# EAGLE design Seeeduino_Mega (EAGLE 5.06)
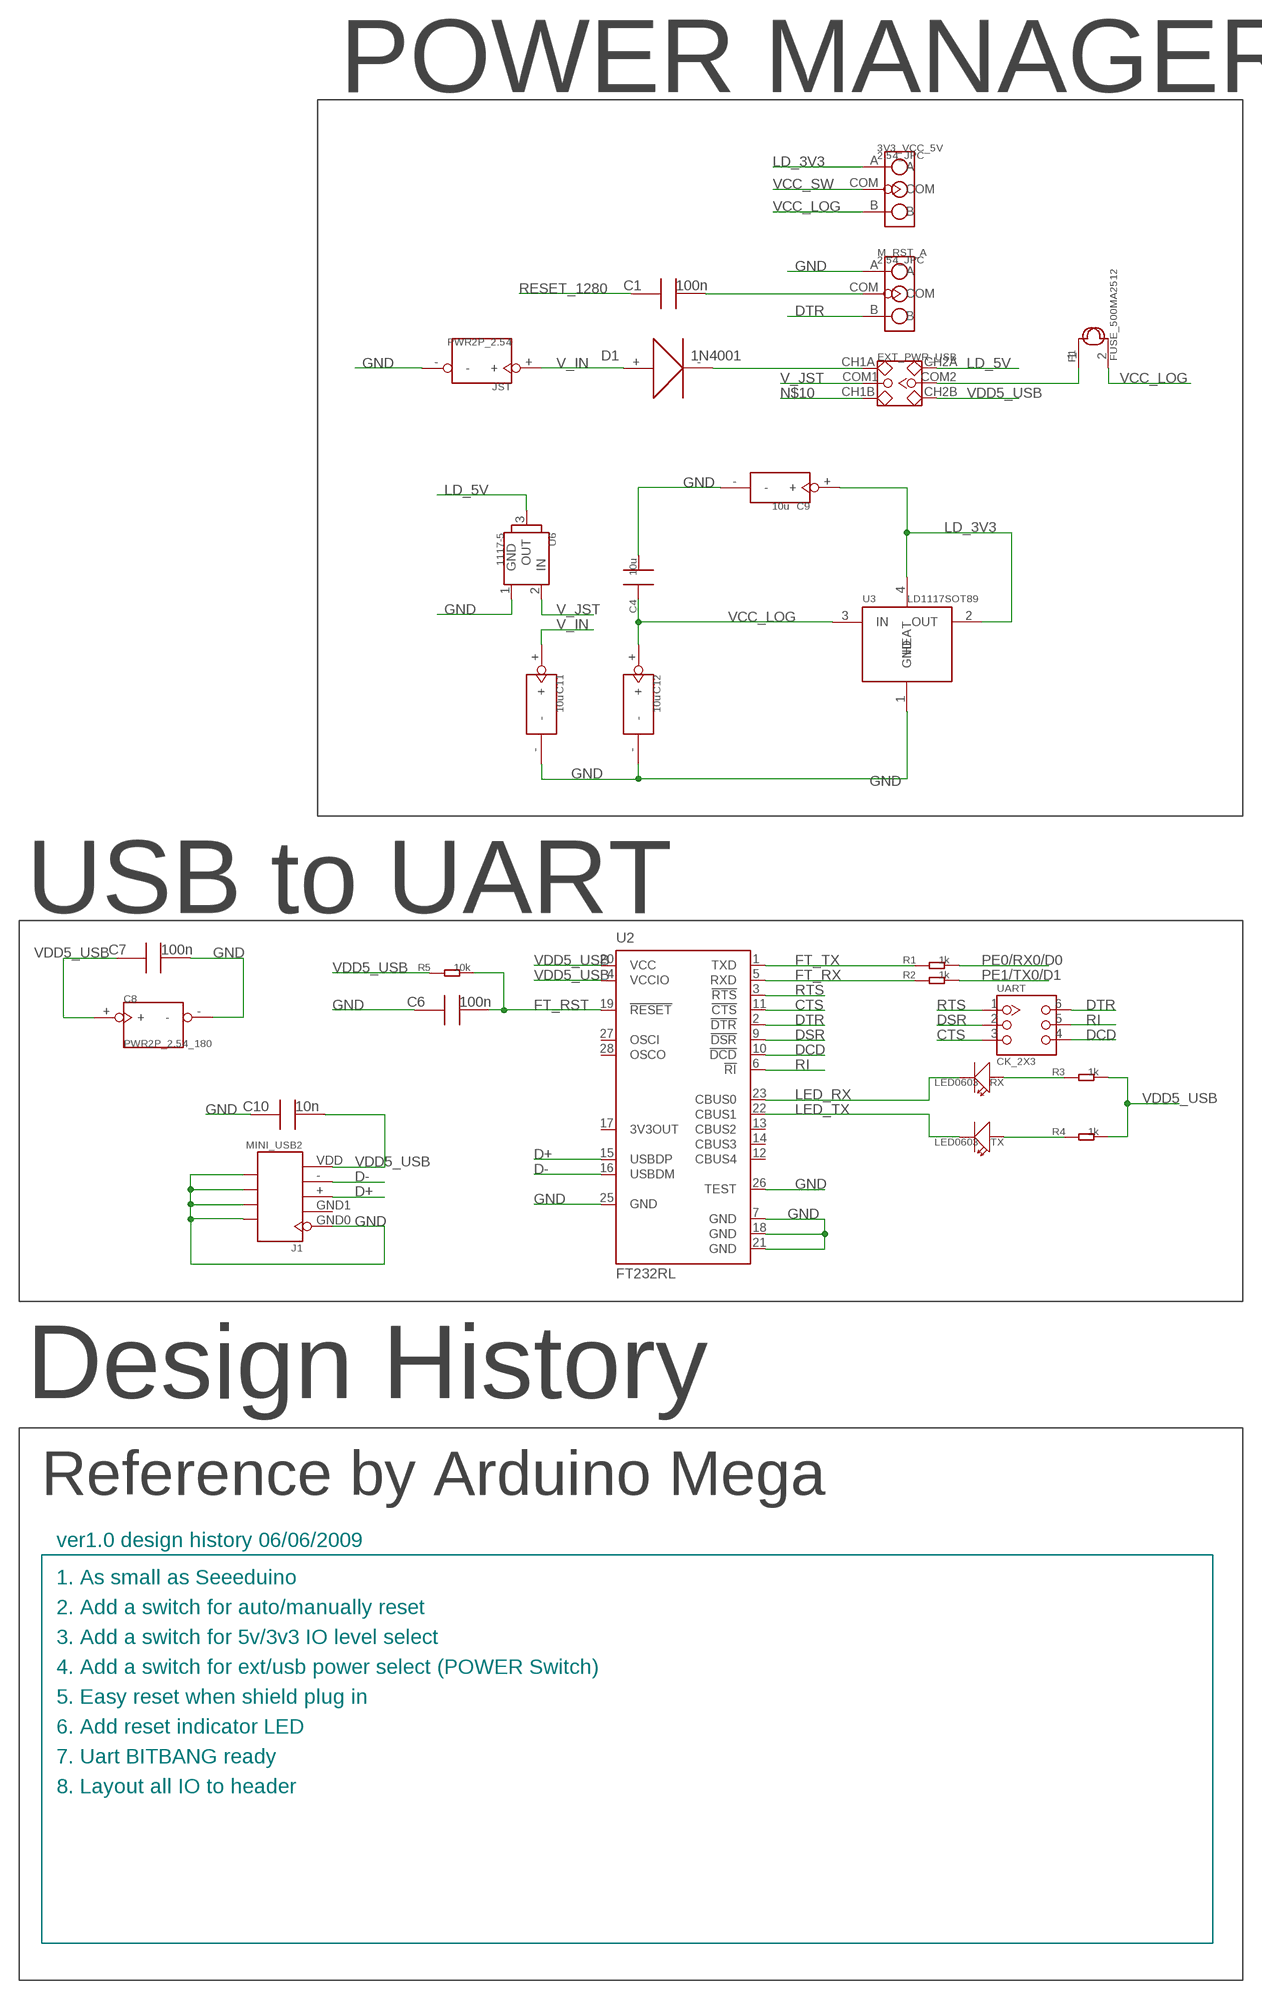
[diagram p0: schematic, sheet 1, part 1 of 2]
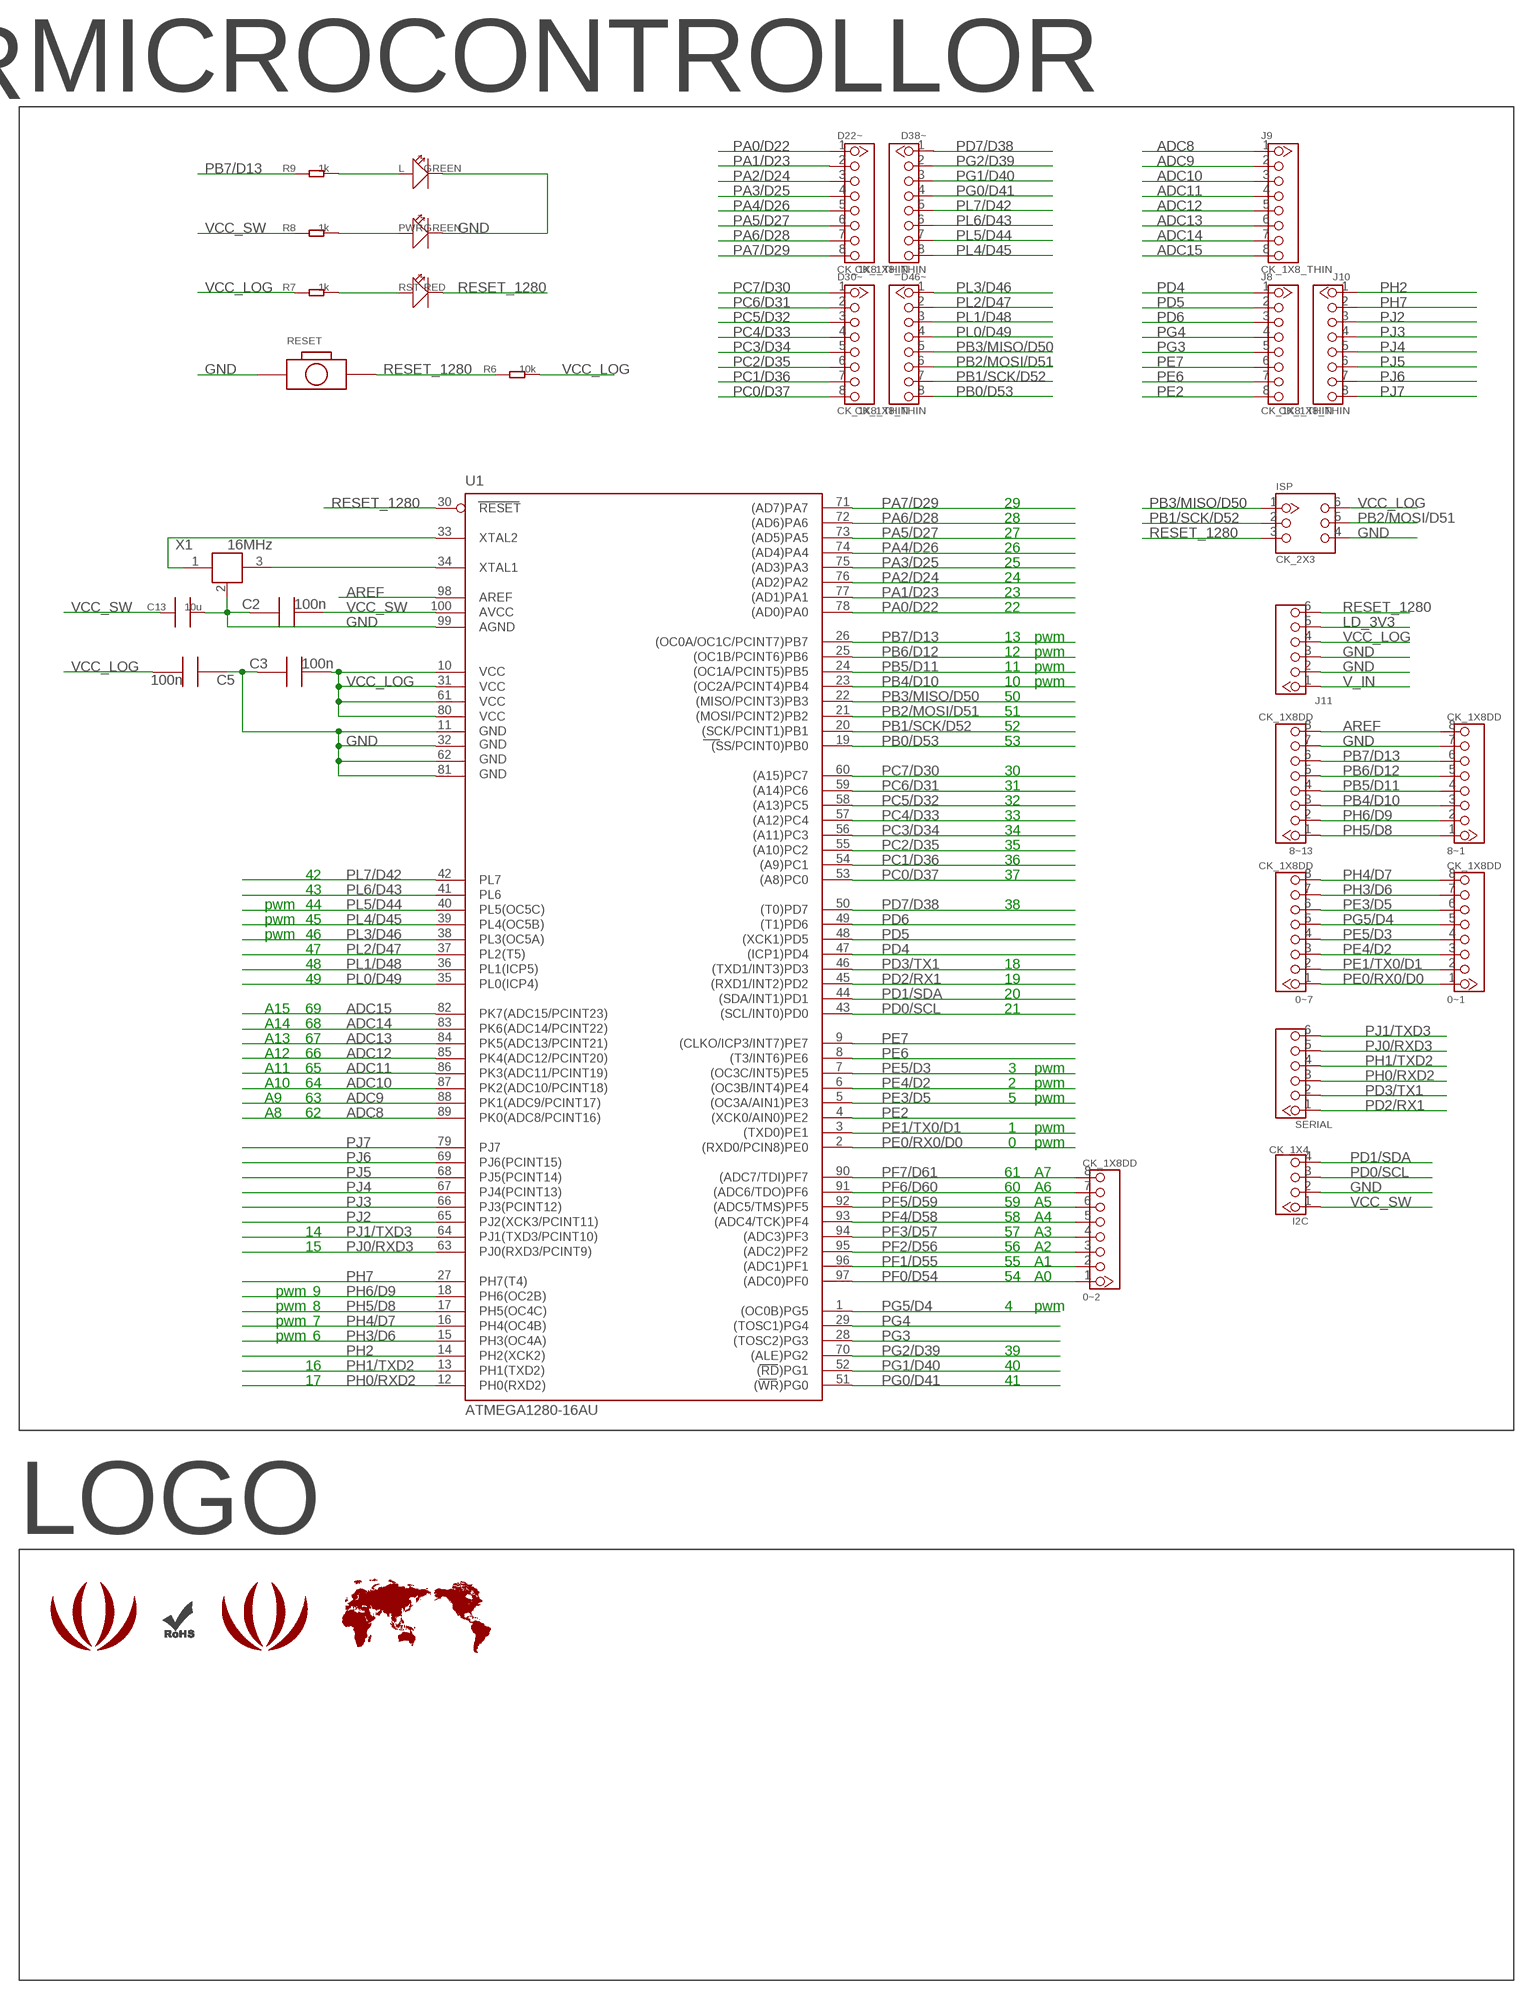
[diagram p1: schematic, sheet 1, part 2 of 2]

## Parts
0~1  CK_1X8DD  [CK_1X8]
0~2  CK_1X8DD  [CK_1X8]
0~7  CK_1X8DD  [CK_1X8]
3V3_VCC_5V  2.54_JPC  [2.54_JP_C]
8~1  CK_1X8DD  [CK_1X8]
8~13  CK_1X8DD  [CK_1X8]
C1  100n  C0603  [0603]
C2  100n  C0603  [0603]
C3  100n  C0603  [0603]
C4  10u  C0805  [0805]
C5  100n  C0603  [0603]
C6  100n  C0603  [0603]
C7  100n  C0603  [0603]
C8  PWR2P_2.54_180  [PWR_1X2]
C9  10u  C_TAN_3X3.5  [C_TAN_3X3.5]
C10  10n  C0603  [0603]
C11  10u  C_TAN_3X3.5  [C_TAN_3X3.5]
C12  10u  C_TAN_3X3.5  [C_TAN_3X3.5]
C13  10u  C0805  [0805]
D1  1N4001  DIODE2010  [DIODE_2010]
D22~  CK_1X8_THIN  [CK_1X8_THIN]
D30~  CK_1X8_THIN  [CK_1X8_THIN]
D38~  CK_1X8_THIN  [CK_1X8_THIN]
D46~  CK_1X8_THIN  [CK_1X8_THIN]
EXT_PWR_USB  2.54SW_2CH  [2.54SW_2CH]
F1  FUSE_500MA2512  [2512]
I2C  CK_1X4  [CK_1X4]
ISP  CK_2X3  [CK_2X3_THIN]
J1  MINI_USB2  [MINI_USB2]
J8  CK_1X8_THIN  [CK_1X8_THIN]
J9  CK_1X8_THIN  [CK_1X8_THIN]
J10  CK_1X8_THIN  [CK_1X8_THIN]
J11  CK_1X6  [CK_1X6]
JST  PWR2P_2.54  [PWR_JST]
L  GREEN  LED0603  [LED0603]
LOGO1  LOGO_SILK  [LOGO_SILK]
LOGO2  ROHSSILK  [ROHS_SILK]
LOGO3  LOGO_COPPER150X124  [LOGO_COPPER_150X124]
M_RST_A  2.54_JPC  [2.54_JP_C]
PWR  GREEN  LED0603  [LED0603]
R1  1k  R0603  [0603]
R2  1k  R0603  [0603]
R3  1k  R0603  [0603]
R4  1k  R0603  [0603]
R5  10k  R0603  [0603]
R6  10k  R0603  [0603]
R7  1k  R0603  [0603]
R8  1k  R0603  [0603]
R9  1k  R0603  [0603]
RESET  BOTTON_1_DP  [BTN_5.0_RST]
RST  RED  LED0603  [LED0603]
RX  LED0603  [LED0603]
SERIAL  CK_1X6  [CK_1X6]
TX  LED0603  [LED0603]
U1  ATMEGA1280-16AU  [TQFP100]
U2  FT232RL  [SSOP28]
U3  LD1117SOT89  [SOT89]
U6  1117-5  [TO252]
U$1  WORLD_MAP_1500X750  [WORLD_MAP_1500X750]
UART  CK_2X3  [CK_2X3_THIN]
X1  16MHz  XTAL_NC4X3  [XTAL_4X3]

## Nets
ADC8: J9.1 U1.89(PK0(ADC8/PCINT16))
ADC9: J9.2 U1.88(PK1(ADC9/PCINT17))
ADC10: J9.3 U1.87(PK2(ADC10/PCINT18))
ADC11: J9.4 U1.86(PK3(ADC11/PCINT19))
ADC12: J9.5 U1.85(PK4(ADC12/PCINT20))
ADC13: J9.6 U1.84(PK5(ADC13/PCINT21))
ADC14: J9.7 U1.83(PK6(ADC14/PCINT22))
ADC15: J9.8 U1.82(PK7(ADC15/PCINT23))
AREF: 8~1.8 8~13.8 U1.98(AREF)
CTS: U2.11(!CTS) UART.3
D+: J1.+ U2.15(USBDP)
D-: J1.- U2.16(USBDM)
DCD: U2.10(!DCD) UART.4
DSR: U2.9(!DSR) UART.2
DTR: M_RST_A.B U2.2(!DTR) UART.6
FT_RST: C6.2 R5.2 U2.19(!RESET)
FT_RX: R2.1 U2.5(RXD)
FT_TX: R1.1 U2.1(TXD)
GND: 8~1.7 8~13.7 C2.1 C3.1 C4.2 C5.1 C6.1 C7.2 C8.- C9.- C10.1 C11.- C12.- C13.2 I2C.2 ISP.4 J1.GND0 J1.P$6 J1.P$7 J1.P$8 J1.P$9 J11.2 J11.3 JST.- L.2(-) M_RST_A.A PWR.2(-) RESET.P$1 U1.11(GND) U1.32(GND1) U1.62(GND2) U1.81(GND3) U1.99(AGND) U2.7(GND) U2.18(GND) U2.21(GND) U2.25(GND) U2.26(TEST) U3.1(GND) U6.1(GND) X1.2(GND)
LD_3V3: 3V3_VCC_5V.A C9.+ J11.5 U3.2(OUT) U3.4(HEAT)
LD_5V: EXT_PWR_USB.CH2A U6.3(OUT)
LED_RX: RX.2(-) U2.23(CBUS0)
LED_TX: TX.2(-) U2.22(CBUS1)
N$1: EXT_PWR_USB.COM2 F1.1
N$2: U1.34(XTAL1) X1.3
N$3: U1.33(XTAL2) X1.1
N$5: R7.2 RST.1(+)
N$7: D1.- EXT_PWR_USB.CH1A
N$8: PWR.1(+) R8.2
N$9: L.1(+) R9.2
N$10: EXT_PWR_USB.CH1B
N$18: C1.2 M_RST_A.COM
N$31: R3.1 RX.1(+)
N$32: R4.1 TX.1(+)
PA0/D22: D22~.1 U1.78((AD0)PA0)
PA1/D23: D22~.2 U1.77((AD1)PA1)
PA2/D24: D22~.3 U1.76((AD2)PA2)
PA3/D25: D22~.4 U1.75((AD3)PA3)
PA4/D26: D22~.5 U1.74((AD4)PA4)
PA5/D27: D22~.6 U1.73((AD5)PA5)
PA6/D28: D22~.7 U1.72((AD6)PA6)
PA7/D29: D22~.8 U1.71((AD7)PA7)
PB0/D53: D46~.8 U1.19((SS/PCINT0)PB0)
PB1/SCK/D52: D46~.7 ISP.2 U1.20((SCK/PCINT1)PB1)
PB2/MOSI/D51: D46~.6 ISP.5 U1.21((MOSI/PCINT2)PB2)
PB3/MISO/D50: D46~.5 ISP.1 U1.22((MISO/PCINT3)PB3)
PB4/D10: 8~1.3 8~13.3 U1.23((OC2A/PCINT4)PB4)
PB5/D11: 8~1.4 8~13.4 U1.24((OC1A/PCINT5)PB5)
PB6/D12: 8~1.5 8~13.5 U1.25((OC1B/PCINT6)PB6)
PB7/D13: 8~1.6 8~13.6 R9.1 U1.26((OC0A/OC1C/PCINT7)PB7)
PC0/D37: D30~.8 U1.53((A8)PC0)
PC1/D36: D30~.7 U1.54((A9)PC1)
PC2/D35: D30~.6 U1.55((A10)PC2)
PC3/D34: D30~.5 U1.56((A11)PC3)
PC4/D33: D30~.4 U1.57((A12)PC4)
PC5/D32: D30~.3 U1.58((A13)PC5)
PC6/D31: D30~.2 U1.59((A14)PC6)
PC7/D30: D30~.1 U1.60((A15)PC7)
PD0/SCL: I2C.3 U1.43((SCL/INT0)PD0)
PD1/SDA: I2C.4 U1.44((SDA/INT1)PD1)
PD2/RX1: SERIAL.1 U1.45((RXD1/INT2)PD2)
PD3/TX1: SERIAL.2 U1.46((TXD1/INT3)PD3)
PD4: J8.1 U1.47((ICP1)PD4)
PD5: J8.2 U1.48((XCK1)PD5)
PD6: J8.3 U1.49((T1)PD6)
PD7/D38: D38~.1 U1.50((T0)PD7)
PE0/RX0/D0: 0~1.1 0~7.1 R1.2 U1.2((RXD0/PCIN8)PE0)
PE1/TX0/D1: 0~1.2 0~7.2 R2.2 U1.3((TXD0)PE1)
PE2: J8.8 U1.4((XCK0/AIN0)PE2)
PE3/D5: 0~1.6 0~7.6 U1.5((OC3A/AIN1)PE3)
PE4/D2: 0~1.3 0~7.3 U1.6((OC3B/INT4)PE4)
PE5/D3: 0~1.4 0~7.4 U1.7((OC3C/INT5)PE5)
PE6: J8.7 U1.8((T3/INT6)PE6)
PE7: J8.6 U1.9((CLKO/ICP3/INT7)PE7)
PF0/D54: 0~2.1 U1.97((ADC0)PF0)
PF1/D55: 0~2.2 U1.96((ADC1)PF1)
PF2/D56: 0~2.3 U1.95((ADC2)PF2)
PF3/D57: 0~2.4 U1.94((ADC3)PF3)
PF4/D58: 0~2.5 U1.93((ADC4/TCK)PF4)
PF5/D59: 0~2.6 U1.92((ADC5/TMS)PF5)
PF6/D60: 0~2.7 U1.91((ADC6/TDO)PF6)
PF7/D61: 0~2.8 U1.90((ADC7/TDI)PF7)
PG0/D41: D38~.4 U1.51((WR)PG0)
PG1/D40: D38~.3 U1.52((RD)PG1)
PG2/D39: D38~.2 U1.70((ALE)PG2)
PG3: J8.5 U1.28((TOSC2)PG3)
PG4: J8.4 U1.29((TOSC1)PG4)
PG5/D4: 0~1.5 0~7.5 U1.1((OC0B)PG5)
PH0/RXD2: SERIAL.3 U1.12(PH0(RXD2))
PH1/TXD2: SERIAL.4 U1.13(PH1(TXD2))
PH2: J10.1 U1.14(PH2(XCK2))
PH3/D6: 0~1.7 0~7.7 U1.15(PH3(OC4A))
PH4/D7: 0~1.8 0~7.8 U1.16(PH4(OC4B))
PH5/D8: 8~1.1 8~13.1 U1.17(PH5(OC4C))
PH6/D9: 8~1.2 8~13.2 U1.18(PH6(OC2B))
PH7: J10.2 U1.27(PH7(T4))
PJ0/RXD3: SERIAL.5 U1.63(PJ0(RXD3/PCINT9))
PJ1/TXD3: SERIAL.6 U1.64(PJ1(TXD3/PCINT10))
PJ2: J10.3 U1.65(PJ2(XCK3/PCINT11))
PJ3: J10.4 U1.66(PJ3(PCINT12))
PJ4: J10.5 U1.67(PJ4(PCINT13))
PJ5: J10.6 U1.68(PJ5(PCINT14))
PJ6: J10.7 U1.69(PJ6(PCINT15))
PJ7: J10.8 U1.79(PJ7)
PL0/D49: D46~.4 U1.35(PL0(ICP4))
PL1/D48: D46~.3 U1.36(PL1(ICP5))
PL2/D47: D46~.2 U1.37(PL2(T5))
PL3/D46: D46~.1 U1.38(PL3(OC5A))
PL4/D45: D38~.8 U1.39(PL4(OC5B))
PL5/D44: D38~.7 U1.40(PL5(OC5C))
PL6/D43: D38~.6 U1.41(PL6)
PL7/D42: D38~.5 U1.42(PL7)
RESET_1280: C1.1 ISP.3 J11.6 R6.1 RESET.P$2 RST.2(-) U1.30(RESET)
RI: U2.6(!RI) UART.5
RTS: U2.3(!RTS) UART.1
V_IN: C11.+ D1.+ J11.1 JST.+
V_JST: EXT_PWR_USB.COM1 U6.2(IN)
VCC_LOG: 3V3_VCC_5V.B C3.2 C4.1 C5.2 C12.+ F1.2 ISP.6 J11.4 R6.2 R7.1 U1.10(VCC) U1.31(VCC1) U1.61(VCC2) U1.80(VCC3) U3.3(IN)
VCC_SW: 3V3_VCC_5V.COM C2.2 C13.1 I2C.1 R8.1 U1.100(AVCC)
VDD5_USB: C7.1 C8.+ C10.2 EXT_PWR_USB.CH2B J1.VDD R3.2 R4.2 R5.1 U2.4(VCCIO) U2.20(VCC)
Unconnected: J1.GND1 U2.12(CBUS4) U2.13(CBUS2) U2.14(CBUS3) U2.17(3V3OUT) U2.27(OSCI) U2.28(OSCO)

## Notes on the sheet
- POWER MANAGER | MICROCONTROLLOR
- 29
- 28
- 27
- 26
- 25
- 24
- 23
- 22
- 13 | pwm
- 12 | pwm
- 11 | pwm
- 10 | pwm
- 50
- 51
- 52
- 53
- 30
- 31
- 32
- 33
- 34
- 35
- 36
- 42 | 37
- 43
- pwm | 44 | 38
- USB to UART
- pwm | 45
- pwm | 46
- 47
- 48 | 18
- 49 | 19
- 20
- A15 | 69 | 21
- A14 | 68
- A13 | 67
- A12 | 66
- A11 | 65 | 3 | pwm
- A10 | 64 | 2 | pwm
- A9 | 63 | 5 | pwm
- A8 | 62
- 1 | pwm
- 0 | pwm
- 61 | A7
- 60 | A6
- 59 | A5
- 58 | A4
- 14 | 57 | A3
- 15 | 56 | A2
- 55 | A1
- 54 | A0
- pwm | 9
- pwm | 8 | 4 | pwm
- pwm | 7
- pwm | 6
- 39
- 16 | 40
- 17 | 41
- Design History
- Reference by Arduino Mega
- LOGO
- ver1.0 design history 06/06/2009
- 1. As small as Seeeduino
- 2. Add a switch for auto/manually reset
- 3. Add a switch for 5v/3v3 IO level select
- 4. Add a switch for ext/usb power select (POWER Switch)
- 5. Easy reset when shield plug in
- 6. Add reset indicator LED
- 7. Uart BITBANG ready
- 8. Layout all IO to header

## Library data of the parts
0~1 0~2 0~7 8~1 8~13 D22~ D30~ D38~ D46~ J8-J10 = CONNECTER:CK_1X8
3V3_VCC_5V M_RST_A = CPT_CJ:2.54_JP
C1-C3 C5-C7 C10 = CPT_SMD:C0603; C0603: 100N
C4 C13 = CPT_SMD:C0805
C8 JST = CONNECTER:PWR2P_2.54
C9 C11 C12 = CPT_SMD:C_TAN
D1 = CPT_SMD:DIODE
EXT_PWR_USB = CPT_CJ:2.54SW_2CH
F1 = CPT_SMD:FUSE_500MA
I2C = CONNECTER:CK_1X4
ISP UART = CONNECTER:CK_2X3
J1 = CONNECTER:MINI_USB2
J11 SERIAL = CONNECTER:CK_1X6
L PWR RST RX TX = CPT_SMD:LED0603
LOGO1 = logo:LOGO_SILK
LOGO2 = logo:ROHS
LOGO3 = logo:LOGO_COPPER
R1-R9 = CPT_SMD:R0603
RESET = CPT_SMD:BOTTON_1
U1 = ICs_v54:ATMEGA*: MICROCONTROLLER 64/128/256 Kbytes FLASH 4 Kbytes EEPROM 8 Kbytes SRAM 86 General Purpose I/O pins 12-channels16-bit PWM 4 x Serial USARTs 16-channels 10-bit A/D
U2 = ICs_v54:FT232R: Source: http://www.ftdichip.com/Documents/DataSheets/DS_FT232R_v104.pdf
U3 = ICs_v54:LD1117
U6 = ICs_v54:1117-5
U$1 = logo:WORLD_MAP
X1 = CPT_SMD:XTAL_NC

## Board
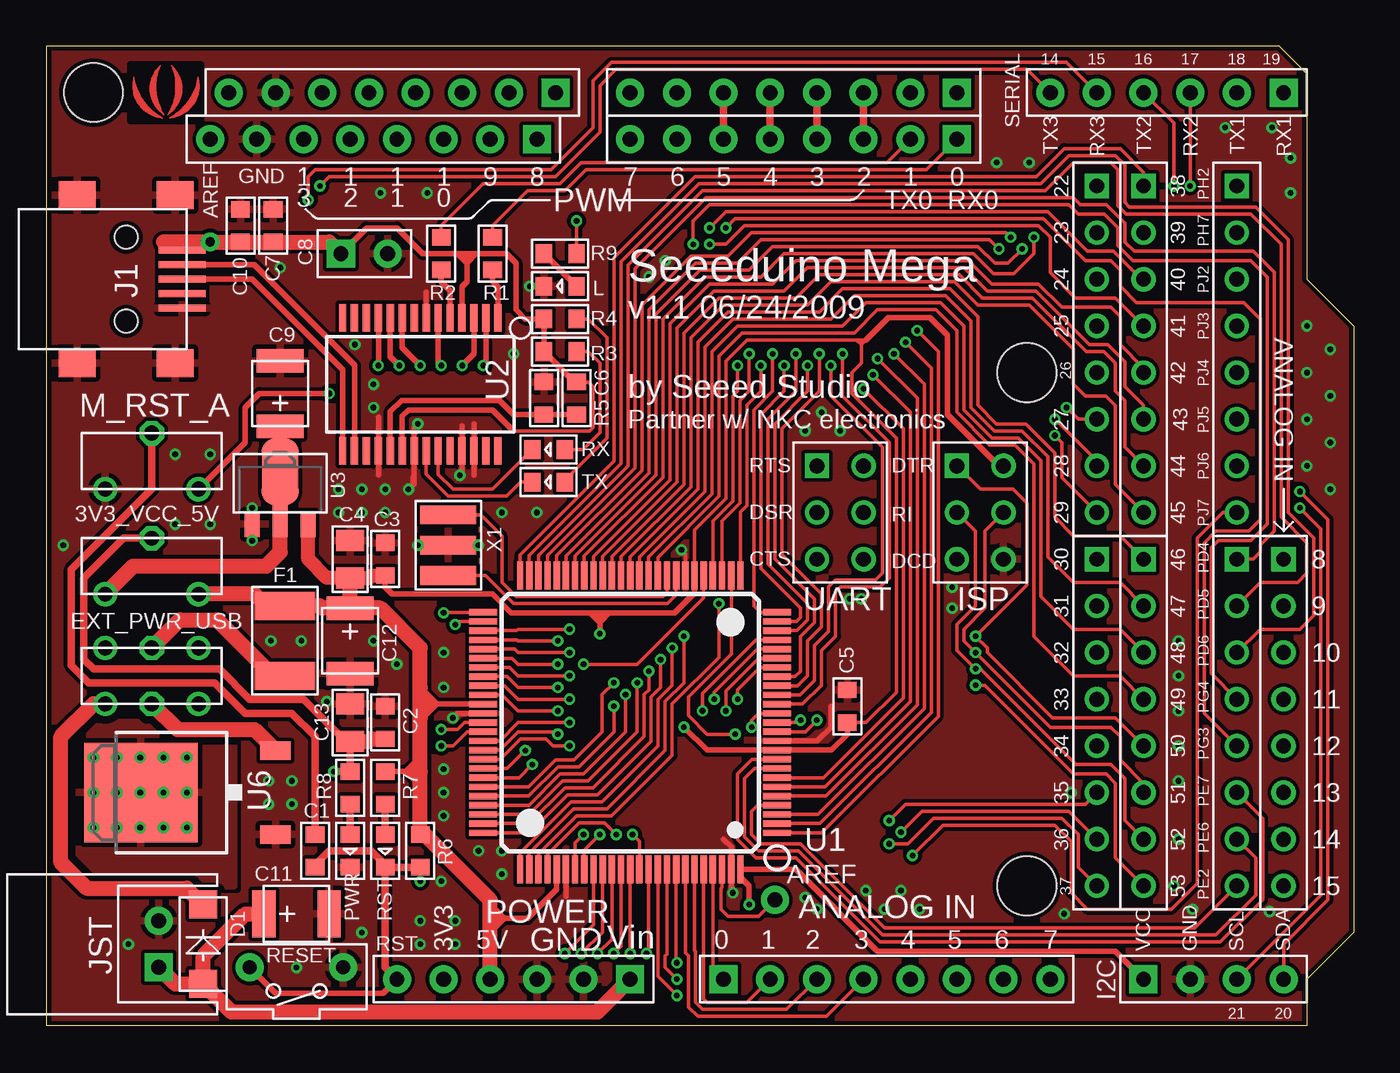
[diagram p2: board, top side]
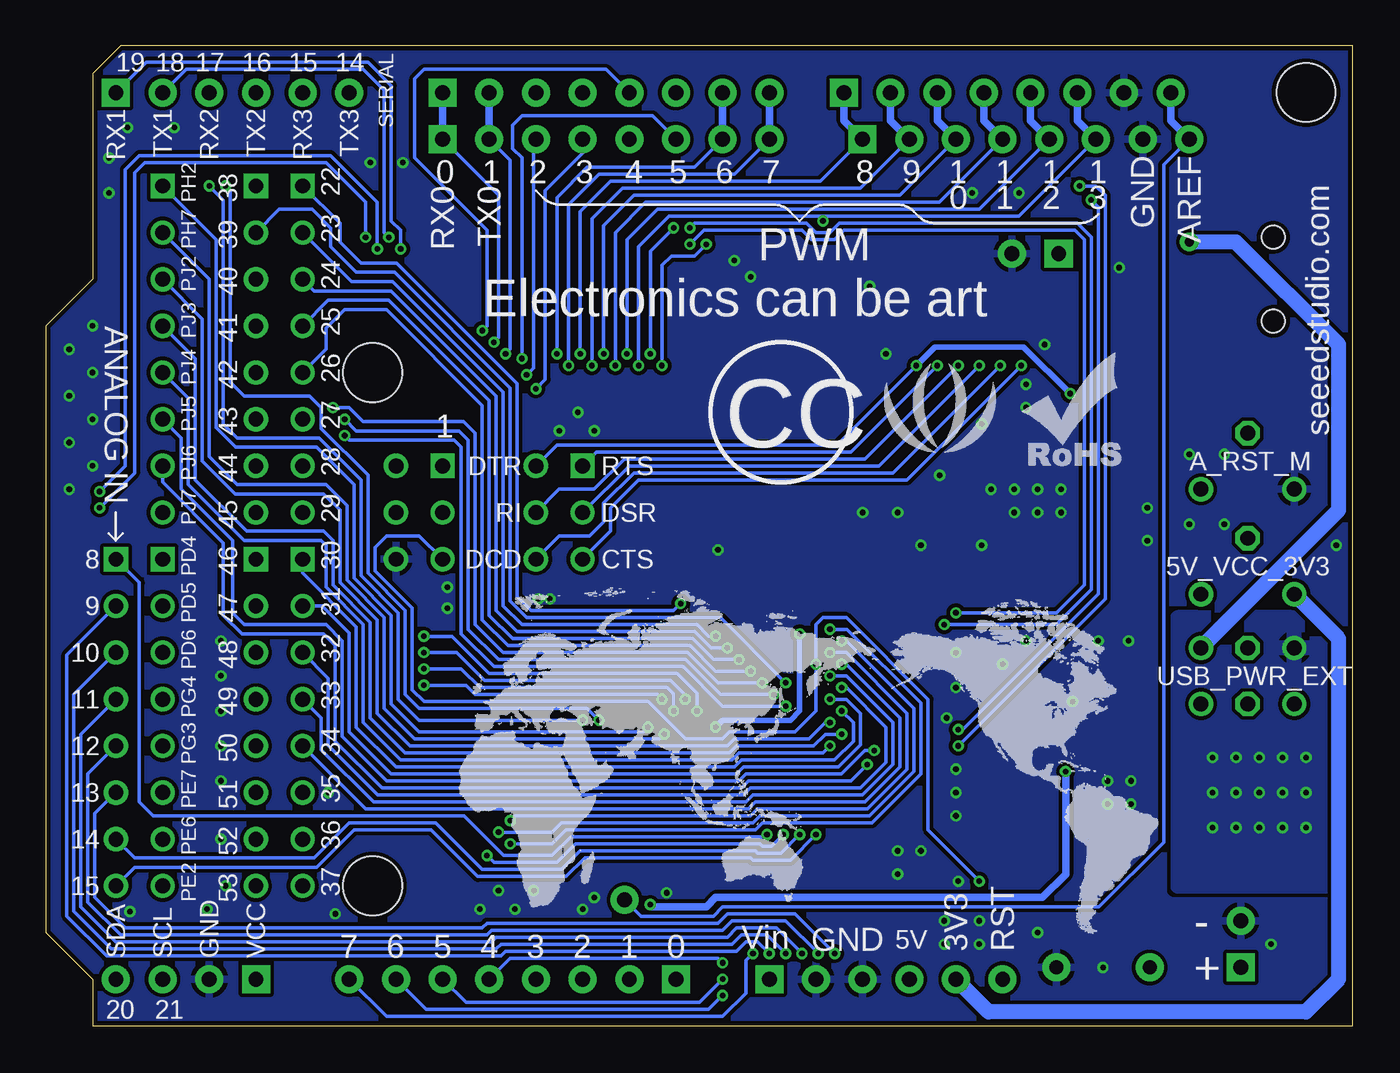
[diagram p3: board, bottom side, seen from below]

Size 71.12 x 53.34 mm. Coordinates in mm from the lower left corner, seen from the top.
Outline: 68.58,40.64 71.12,38.1 71.12,5.08 68.58,2.54 68.58,0 0,0 0,53.34 67.06,53.34 68.58,51.82 68.58,40.64
Copper layers (1*16): Top 0.035mm / dielectric 1.5mm / Bottom 0.035mm
Design rules "rule_manufacture *": minimum track width 8mil, minimum drill 12mil, track to track 6mil, track to pad 6mil, pad to pad 6mil, via to via 8mil, smd to smd 0mil, copper to edge 10mil, drill to drill 10mil, minimum pad ring 10mil, minimum via ring 6mil, stop-mask expansion 2mil, vias tented up to drill 25mil, thermal gap 10mil
Holes 3.2 mm at 2.54,50.8 2.54,50.8 53.34,7.62 53.34,35.56
tRestrict: area 22.5,30.6 to 23.4,32; area 17.3,30.6 to 18.2,32; area 19.3,30.6 to 20.7,32; area 4.6,49.3 to 8.4,52.3; area 20.1,37.8 to 21.2,39.2

### Footprints (pad centres in the part's own frame; a part is rotated, then mirrored left to right if it is on the bottom)
CK_1X8 = drill 0.813 pad 1.524 square: 1 0,8.89 | drill 0.813 pad 1.524 round: 2 0,6.35; 3 0,3.81; 4 0,1.27; 5 0,-1.27; 6 0,-3.81; 7 0,-6.35; 8 0,-8.89
2.54_JP_C = drill 0.813 round: A -1.27,2.54; B -1.27,-2.54 | drill 0.813 octagon: COM 1.778,0
0603 = smd 0.889 x 1.016: 1 -0.889,0; 2 0.889,0
0805 = smd 1.143 x 1.524: 1 -1.016,0; 2 1.016,0
PWR_1X2 = drill 0.813 pad 1.524 square: + 1.27,0 | drill 0.813 pad 1.524 round: - -1.27,0
C_TAN_3X3.5 = smd 2.54 x 1.27: + 0,1.778; - 0,-1.778
DIODE_2010 = smd 1.524 x 1.524: + 0,-2.159; - 0,2.159
CK_1X8_THIN = drill 0.813 pad 1.27 square: 1 0,8.89 | drill 0.813 pad 1.27 round: 2 0,6.35; 3 0,3.81; 4 0,1.27; 5 0,-1.27; 6 0,-3.81; 7 0,-6.35; 8 0,-8.89
2.54SW_2CH = drill 0.813 pad 1.27 round: CH1A -1.524,2.54; CH1B -1.524,-2.54; CH2A 1.524,2.54; CH2B 1.524,-2.54 | drill 0.813 pad 1.27 octagon: COM1 -1.524,0; COM2 1.524,0
2512 = smd 1.524 x 3.302: 1 -1.905,0; 2 1.905,0
CK_1X4 = drill 0.813 pad 1.524 square: 1 0,3.81 | drill 0.813 pad 1.524 round: 2 0,1.27; 3 0,-1.27; 4 0,-3.81
CK_2X3_THIN = drill 0.813 pad 1.27 square: 1 -1.27,2.54 | drill 0.813 pad 1.27 round: 2 -1.27,0; 3 -1.27,-2.54; 4 1.27,-2.54; 5 1.27,0; 6 1.27,2.54
MINI_USB2 = smd 2.54 x 0.381: + -2.286,0; - -2.286,-0.787; GND0 -2.286,1.575; GND1 -2.286,0.787; VDD -2.286,-1.575 | smd 2.032 x 1.524: P$6 -1.905,4.572; P$7 -1.905,-4.572; P$8 3.429,4.572; P$9 3.429,-4.572 | hole 1.27: 0.762,2.286; 0.762,-2.286
CK_1X6 = drill 0.813 pad 1.524 square: 1 0,6.35 | drill 0.813 pad 1.524 round: 2 0,3.81; 3 0,1.27; 4 0,-1.27; 5 0,-3.81; 6 0,-6.35
PWR_JST = drill 0.813 pad 1.524 square: + 0,-1.27 | drill 0.813 pad 1.524 round: - 0,1.27
LED0603 = smd 0.889 x 1.016: 1 -0.889,0; 2 0.889,0
BTN_5.0_RST = drill 0.762 pad 1.524 round: P$1 0,2.54; P$2 0,-2.54
TQFP100 = smd 1.524 x 0.343: 1 -8,6; 2 -8,5.5; 3 -8,5; 4 -8,4.5; 5 -8,4; 6 -8,3.5; 7 -8,3; 8 -8,2.5; 9 -8,2; 10 -8,1.5; 11 -8,1; 12 -8,0.5; 13 -8,0; 14 -8,-0.5; 15 -8,-1; 16 -8,-1.5; 17 -8,-2; 18 -8,-2.5; 19 -8,-3; 20 -8,-3.5; 21 -8,-4; 22 -8,-4.5; 23 -8,-5; 24 -8,-5.5; 25 -8,-6; 51 8,-6; 52 8,-5.5; 53 8,-5; 54 8,-4.5; 55 8,-4; 56 8,-3.5; 57 8,-3; 58 8,-2.5; 59 8,-2; 60 8,-1.5; 61 8,-1; 62 8,-0.5; 63 8,0; 64 8,0.5; 65 8,1; 66 8,1.5; 67 8,2; 68 8,2.5; 69 8,3; 70 8,3.5; 71 8,4; 72 8,4.5; 73 8,5; 74 8,5.5; 75 8,6 | smd 0.343 x 1.524: 26 -6,-8; 27 -5.5,-8; 28 -5,-8; 29 -4.5,-8; 30 -4,-8; 31 -3.5,-8; 32 -3,-8; 33 -2.5,-8; 34 -2,-8; 35 -1.5,-8; 36 -1,-8; 37 -0.5,-8; 38 0,-8; 39 0.5,-8; 40 1,-8; 41 1.5,-8; 42 2,-8; 43 2.5,-8; 44 3,-8; 45 3.5,-8; 46 4,-8; 47 4.5,-8; 48 5,-8; 49 5.5,-8; 50 6,-8; 76 6,8; 77 5.5,8; 78 5,8; 79 4.5,8; 80 4,8; 81 3.5,8; 82 3,8; 83 2.5,8; 84 2,8; 85 1.5,8; 86 1,8; 87 0.5,8; 88 0,8; 89 -0.5,8; 90 -1,8; 91 -1.5,8; 92 -2,8; 93 -2.5,8; 94 -3,8; 95 -3.5,8; 96 -4,8; 97 -4.5,8; 98 -5,8; 99 -5.5,8; 100 -6,8
SSOP28 = smd 0.4 x 1.5: 1 -4.225,-3.625; 2 -3.575,-3.625; 3 -2.925,-3.625; 4 -2.275,-3.625; 5 -1.625,-3.625; 6 -0.975,-3.625; 7 -0.325,-3.625; 8 0.325,-3.625; 9 0.975,-3.625; 10 1.625,-3.625; 11 2.275,-3.625; 12 2.925,-3.625; 13 3.575,-3.625; 14 4.225,-3.625; 15 4.225,3.625; 16 3.575,3.625; 17 2.925,3.625; 18 2.275,3.625; 19 1.625,3.625; 20 0.975,3.625; 21 0.325,3.625; 22 -0.325,3.625; 23 -0.975,3.625; 24 -1.625,3.625; 25 -2.275,3.625; 26 -2.925,3.625; 27 -3.575,3.625; 28 -4.225,3.625
SOT89 = smd 0.8 x 1.4: 1 -1.524,-1.905; 3 1.524,-1.905 | smd 0.8 x 1.9: 2 0,-1.651 | smd 2.032 x 3.65: 4 0,0.94
TO252 = smd 1.016 x 1.651: 1 -2.286,-4.826; 2 2.286,-4.826 | smd 5.4 x 6.2: 3 0,2.5
XTAL_4X3 = smd 1.016 x 3.048: 1 -1.651,0; 2 0,0; 3 1.651,0

### Placement (x,y rotation side)
0~1  40.64,48.26 270 top
0~2  45.72,2.54 90 top
0~7  40.64,50.8 270 top
3V3_VCC_5V  5.71,24.77 90 top
8~1  17.78,48.26 270 top
8~13  18.8,50.8 270 top
C1  14.61,9.53 90 top
C2  18.41,16.51 270 top
C3  18.41,25.4 270 top
C4  16.51,25.4 90 top
C5  43.56,17.4 270 top
C6  27.05,34.16 270 top
C7  12.32,43.56 90 top
C8  17.27,42.04 180 top
C9  12.7,34.42 180 top
C10  10.54,43.56 270 top
C11  13.59,6.1 90 top
C12  16.51,20.95 0 top
C13  16.51,16.51 90 top
D1  8.51,4.45 0 top
D22~  57.15,36.83 0 top
D30~  57.15,16.51 0 top
D38~  59.69,36.83 0 top
D46~  59.69,16.51 0 top
EXT_PWR_USB  5.71,19.05 90 top
F1  12.95,20.95 90 top
I2C  63.5,2.54 90 top
ISP  50.8,27.94 0 top
J1  5.08,40.64 180 top
J8  64.77,16.51 0 top
J9  67.31,16.51 0 top
J10  64.77,36.83 0 top
J11  25.4,2.54 270 top
JST  6.1,4.45 0 top
L  27.94,40.26 180 top
LOGO1  22.48,32.89 0 bottom
LOGO2  15.88,32.89 0 bottom
LOGO3  6.48,50.55 0 top
M_RST_A  5.71,30.48 90 top
PWR  16.51,9.53 270 top
R1  24.26,42.04 90 top
R2  21.46,42.04 90 top
R3  27.94,36.7 180 top
R4  27.94,38.48 180 top
R5  28.83,34.16 270 top
R6  20.32,9.53 90 top
R7  18.41,12.95 270 top
R8  16.51,12.95 270 top
R9  27.94,42.04 180 top
RESET  13.59,3.17 270 top
RST  18.41,9.53 270 top
RX  27.3,31.37 180 top
SERIAL  60.96,50.8 270 top
TX  27.3,29.59 180 top
U1  31.75,16.51 180 top
U2  20.32,34.92 180 top
U3  12.7,29.21 0 top
U6  7.62,12.7 90 top
U$1  34.29,14.35 0 bottom
UART  43.18,27.94 0 top
X1  21.84,26.16 90 top

### Tracks (layer width: path | path; a pad name or v marks a point on that pad's centre or on a via)
ADC8  (via drill 0.3)
  Top 0.203: U1.89 32.25,10.04 v31.88,10.41
  Bottom 0.203: J9.1 66.04,24.13 66.04,12.19 65.28,11.43 48.36,11.43 46.2,9.27 43.56,9.27 42.55,10.29 32,10.29 v31.88,10.41
ADC9  (via drill 0.3)
  Top 0.203: v31.75,3.94 U1.88
  Bottom 0.203: v31.75,3.94 32.38,4.57 33.02,4.57 33.53,4.06 46.1,4.06 46.35,3.81 67.82,3.81 69.98,5.97 69.98,20.19 J9.2
ADC10  (via drill 0.3)
  Top 0.203: U1.87 31.25,4.33 v30.86,3.94
  Bottom 0.203: v30.86,3.94 31.88,4.95 33.27,4.95 33.78,4.45 46.35,4.45 46.61,4.19 67.56,4.19 69.6,6.22 69.6,18.03 J9.3
ADC11  (via drill 0.3)
  Top 0.203: U1.86 30.75,4.71 v29.97,3.94
  Bottom 0.203: v29.97,3.94 31.37,5.33 33.53,5.33 34.04,4.83 46.61,4.83 46.86,4.57 67.31,4.57 69.22,6.48 69.22,15.88 J9.4
ADC12  (via drill 0.3)
  Top 0.203: U1.85 30.25,5.1 v29.08,3.94
  Bottom 0.203: v29.08,3.94 30.86,5.71 33.78,5.71 34.29,5.21 46.86,5.21 47.12,4.95 67.06,4.95 68.83,6.73 68.83,13.72 J9.5
ADC13  (via drill 0.3)
  Top 0.203: U1.84 29.75,5.49 v28.19,3.94
  Bottom 0.203: v28.19,3.94 30.35,6.1 34.04,6.1 34.54,5.59 47.12,5.59 47.37,5.33 66.8,5.33 68.45,6.99 68.45,11.56 J9.6
ADC14  (via drill 0.3)
  Top 0.203: U1.83 29.25,9.56 v30.1,10.41
  Bottom 0.203: J9.7 66.29,9.14 56.52,9.14 54.61,11.05 49.91,11.05 47.37,8.51 43.05,8.51 42.04,9.53 32.51,9.53 32.38,9.4 31.11,9.4 v30.1,10.41
ADC15  (via drill 0.3)
  Top 0.203: U1.82 28.75,9.95 v29.21,10.41
  Bottom 0.203: J9.8 66.29,8.64 56.39,8.64 54.36,10.67 50.16,10.67 47.62,8.13 42.8,8.13 41.78,9.14 32.77,9.14 32.64,9.02 30.61,9.02 v29.21,10.41
AREF  (via drill 0.81 pad 1.52)
  Top 0.203: U1.98 36.75,7.54 36.7,7.49 36.7,6.35 37.08,5.97 38.73,5.97 v39.62,6.86
  Bottom 0.203: 8~1.8 10.29,46.86 10.29,9.99 13.8,6.48 34.29,6.48 34.8,5.97 38.73,5.97 v39.62,6.86
  Bottom 0.406: 8~1.8 9.91,49.28 8~13.8
CTS  (via drill 0.3)
  Top 0.305: U2.11 18.05,35.95 v18.03,35.94
  Bottom 0.203: v18.03,35.94 24.26,29.72 38.86,29.72 40.39,28.19 40.39,26.92 UART.3
D+
  Top 0.305: J1.+ 11.18,40.64 16.09,35.72 U2.15
D-
  Top 0.305: J1.- 11.28,41.43 16.75,35.96 U2.16
DCD  (via drill 0.3)
  Top 0.305: U2.10 18.7,36.42 v19.18,35.94
  Bottom 0.203: v19.18,35.94 25.02,30.1 39.12,30.1 40.77,28.45 40.77,27.43 41.53,26.67 43.18,26.67 UART.4
DSR  (via drill 0.3)
  Top 0.305: U2.9 19.34,36.92 v20.32,35.94
  Bottom 0.203: v20.32,35.94 25.78,30.48 39.37,30.48 UART.2
DTR  (via drill 0.3)
  Top 0.305: U2.2 23.89,36.09 v23.75,35.94 | M_RST_A.B 10.79,31.75 10.79,33.66 11.56,34.42 v15.37,34.42
  Bottom 0.203: v23.75,35.94 28.07,31.62 43.31,31.62 UART.6
  Bottom 0.305: v23.75,35.94 22.73,36.96 17.91,36.96 v15.37,34.42
FT_RST
  Top 0.305: R5.2 C6.2 25.4,33.27 24.64,34.04 19.3,34.04 18.7,33.43 U2.19
FT_RX
  Top 0.305: U2.5 21.95,40.03 21.46,40.51 R2.1
FT_TX
  Top 0.305: U2.1 24.55,40.23 24.26,40.51 R1.1
GND  (via drill 0.3)
  Top 0.203: U1.32 34.75,25.7 v34.54,25.91
  Top 0.305: 18.05,33.14 U2.18 18.05,29.98 | 28.25,7.04 U1.81 | 23.24,29.97 23.25,29.98 23.24,29.98 23.24,32.77 23.25,32.76 U2.26 | U2.25 22.59,32.63 22.61,32.64 22.61,30.1 v22.48,29.97 | U1.62 22.34,17.01 v22.1,16.76 | 36.83,10.16 37.25,9.74 U1.99 37.25,7.33 v37.34,7.24 | U1.11 41.93,15.51 42.67,16.26 42.67,17.4 | 20,29.9 19.94,29.84 19.94,29.46 v19.68,29.21 20,29.52 U2.21 20,32.57 v20.19,32.77 | U2.7 20.64,39.93
  other vias: 11.18,28.19 11.18,26.42 23.5,26.16 20.19,26.16 17.78,34.92 12.19,20.95 18.41,29.21 12.06,13.34 13.34,13.34 13.34,12.06 15.24,17.65 25.4,36.58 26.29,40.26 41.27,6.99 55.37,6.1 44.58,7.37 45.59,6.35 46.48,7.37 47.5,6.35 62.36,6.35 66.55,6.22 13.84,20.95 23.5,9.53 21.46,7.87 22.23,5.71 49.28,23.88 49.28,22.73 41.91,6.35 17.14,29.21 15.88,29.21 15.88,27.94 17.14,27.94 18.41,27.94 21.59,18.41 21.59,20.32 17.78,20.95 12.06,12.06 4.45,4.45 13.59,3.17 17.14,5.08 20.32,5.71 20.32,4.45 22.23,4.45 24.77,9.53 24.77,8.26 21.59,13.97 21.59,12.7 21.59,11.43 19.05,19.68 8.89,27.3 6.99,27.3 6.99,31.11 8.89,31.11 16.76,37.08 17.78,33.66 12.7,41.27 18.16,45.34 20.7,45.34 66.67,48.9 64.14,48.9 61.59,20.95 61.59,19.05 61.59,17.14 61.59,15.24 61.59,13.34 61.59,10.16 67.69,47.24 67.69,45.34 69.85,36.83 68.58,38.1 68.58,35.56 68.58,33.02 68.58,30.48 69.85,34.29 69.85,31.75 69.85,29.21 24.77,27.94 26.67,27.94 41.27,32.38 43.18,32.38 42.16,33.4 32.77,40.77 33.66,41.66 53.47,46.99 51.69,46.99 0.89,26.16 55.75,12.7 61.34,7.62 43.69,23.24 44.32,23.24
  pour Top: -7.62,53.34 -5.08,53.34 -5.08,51.44 -7.62,51.44
  pour Bottom (isolate 0.203, rank 6): 0,53.34 67.03,53.34 68.58,51.79 68.58,40.64 71.12,38.1 71.12,5.08 68.58,2.54 68.58,0 0,0
  pour Top (isolate 0.203, rank 6): 0,53.34 67.03,53.34 68.58,51.79 68.58,40.64 71.12,38.1 71.12,5.08 68.58,2.54 68.58,0 0,0
LD_3V3
  Top 0.813: C9.+ U3.4 U3.2 12.7,25.78 11.94,25.02 4.7,25.02 3V3_VCC_5V.A
  Bottom 0.813: J11.5 19.81,0.76 2.54,0.76 0.76,2.54 0.76,21.08 3V3_VCC_5V.A
LD_5V  (via drill 0.3)
  Top 0.203: U6.3 v5.08,12.7
  other vias: 2.54,14.61 3.81,14.61 5.08,14.61 6.35,14.61 2.54,12.7 3.81,12.7 6.35,12.7 7.62,12.7 5.08,10.79 2.54,10.79 6.35,10.79 7.62,10.79 7.62,14.61 3.81,10.79
  pour Bottom (isolate 0.203): 0,7.62 0,19.69 2.53,22.23 9.53,22.23 9.53,7.62
  pour Top (isolate 0.406): 10.16,16.51 10.16,7.62 2.71,7.62 1.27,9.06 1.27,15.52 2.26,16.51
LED_RX
  Top 0.203: U2.23 21.3,30.01 22.1,29.21 24.26,29.21 RX.2
LED_TX
  Top 0.203: U2.22 20.64,30.03 21.84,28.83 25.02,28.83 25.78,29.59 TX.2
N$1
  Top 0.813: F1.1 12.32,19.05 9.27,22.1 7.24,22.1 EXT_PWR_USB.COM2
N$2
  Top 0.203: U1.34 33.75,23.59 33.53,23.37 25.53,23.37 24.77,24.13 24.77,26.67 23.62,27.81 X1.3
N$3
  Top 0.203: U1.33 34.25,23.45 33.78,22.99 25.4,22.99 23.88,24.51 X1.1
N$5
  Top 0.406: R7.2 RST.1
N$7
  Top 0.813: EXT_PWR_USB.CH1A 2.54,17.53 0.76,15.75 0.76,8.89 2.16,7.49 7.62,7.49 D1.-
N$8
  Top 0.406: R8.2 PWR.1
N$9
  Top 0.305: R9.2 L.1
N$18
  Top 0.406: M_RST_A.COM 5.71,29.21 1.34,24.83 1.34,19.62 2.29,18.67 9.14,18.67 10.79,17.02 13.34,17.02 14.61,15.75 C1.2
N$31
  Top 0.203: R3.1 29.46,36.7 30.1,36.07 30.1,32.28 29.18,31.37 RX.1
N$32
  Top 0.203: R4.1 29.46,38.48 30.48,37.47 30.48,32 28.19,29.72 TX.1
PA0/D22  (via drill 0.3)
  Top 0.203: U1.78 26.75,9.36 28.82,11.43 30.73,11.43 34.04,14.73 34.04,17.53 36.58,20.07 v36.58,22.99
  Bottom 0.203: D22~.1 55.12,43.69 55.12,42.67 53.98,41.53 52.05,41.53 45.47,34.95 45.47,23.37 44.7,22.61 36.96,22.61 v36.58,22.99
PA1/D23  (via drill 0.3)
  Top 0.203: U1.77 26.25,9.39 28.67,11.81 30.48,11.81 33.66,14.99 33.66,17.65 34.67,18.67 v34.67,21.21
  Bottom 0.203: D22~.2 54.48,40.51 52.25,40.51 46.23,34.49 46.23,22.86 45.21,21.84 35.69,21.84 35.05,21.21 v34.67,21.21
PA2/D24  (via drill 0.3)
  Top 0.203: U1.76 25.75,9.42 28.53,12.19 30.23,12.19 33.27,15.24 33.27,17.78 34.04,18.54 v34.04,20.57
  Bottom 0.203: v34.04,20.57 34.92,20.57 35.81,21.46 45.47,21.46 46.61,22.61 46.61,34.27 52.35,40.01 56.52,40.01 D22~.3
PA3/D25  (via drill 0.3)
  Top 0.203: U1.75 26.28,10.51 28.35,12.57 29.97,12.57 32.89,15.49 32.89,17.91 33.4,18.41 v33.4,19.94
  Bottom 0.203: v33.4,19.94 34.8,19.94 35.94,21.08 45.72,21.08 46.99,22.35 46.99,34.03 52.46,39.5 55.75,39.5 D22~.4
PA4/D26  (via drill 0.3)
  Top 0.203: U1.74 26.25,11.01 28.19,12.95 29.72,12.95 32.51,15.75 32.51,18.03 32.77,18.29 v32.77,19.3
  Bottom 0.203: v32.77,19.3 34.67,19.3 36.07,20.7 45.97,20.7 47.37,22.1 47.37,33.78 52.58,38.99 54.86,38.99 55.88,37.97 55.88,36.83 D22~.5
PA5/D27  (via drill 0.3)
  Top 0.203: U1.73 26.24,11.51 28.07,13.34 29.46,13.34 32.13,16 v32.13,18.67 | D22~.6 56.13,33.02 v55.5,33.66
  Bottom 0.203: v32.13,18.67 34.54,18.67 36.2,20.32 46.23,20.32 47.75,21.84 47.75,32.26 48.39,32.89 53.85,32.89 54.61,33.66 v55.5,33.66
PA6/D28  (via drill 0.3)
  Top 0.203: U1.72 26.23,12.01 27.94,13.72 29.21,13.72 31.5,16 v31.5,18.03 | v54.86,33.02 57.15,30.73 D22~.7
  Bottom 0.203: v54.86,33.02 54.23,32.38 48.64,32.38 48.13,31.88 48.13,21.59 46.48,19.94 36.32,19.94 34.42,18.03 v31.5,18.03
PA7/D29  (via drill 0.3)
  Top 0.203: U1.71 26.23,12.51 27.81,14.1 28.96,14.1 30.86,16 v30.86,17.4 | v54.86,32.13 55.24,31.75 55.24,29.84 D22~.8
  Bottom 0.203: v54.86,32.13 54.61,31.88 48.9,31.88 48.51,31.5 48.51,21.34 46.74,19.56 36.45,19.56 34.29,17.4 v30.86,17.4
PB0/D53  (via drill 0.3)
  Top 0.203: D46~.8 58.17,9.14 58.17,13.21 57.66,13.72 55.88,13.72 51.05,18.54 v50.55,18.54 | U1.19 38.81,19.51 37.59,18.29 v37.59,17.78
  Bottom 0.203: v37.59,17.78 37.85,18.03 47.75,18.03 48.26,18.54 v50.55,18.54
PB1/SCK/D52  (via drill 0.3)
  Top 0.203: D46~.7 58.67,11.18 58.67,13.46 57.91,14.22 56.01,14.22 50.8,19.43 v50.55,19.43 49.53,20.45 49.53,21.84 50.55,22.86 50.55,26.92 ISP.2 | U1.20 38.74,20.01 36.96,18.23 v36.96,17.14
  Bottom 0.203: v36.96,17.14 36.96,18.06 37.32,18.41 47.5,18.41 48.51,19.43 v50.55,19.43
PB2/MOSI/D51  (via drill 0.3)
  Top 0.203: 59.69,13.08 D46~.6 59.69,13.21 58.42,14.48 58.42,15.75 57.91,16.26 54.61,16.26 v50.55,20.32 49.91,20.95 49.91,21.59 51.05,22.73 51.05,26.92 ISP.5 | U1.21 38.67,20.51 36.32,18.16 v36.32,17.78
  Bottom 0.203: v36.32,17.78 36.32,17.98 37.13,18.8 47.24,18.8 48.77,20.32 v50.55,20.32
PB3/MISO/D50  (via drill 0.3)
  Top 0.203: D46~.5 58.17,16.76 54.74,16.76 51.18,20.32 51.18,20.57 v50.55,21.21 53.34,24 53.34,28.45 52.58,29.21 50.8,29.21 ISP.1 | U1.22 38.6,21.01 35.69,18.1 v35.69,17.14
  Bottom 0.203: v35.69,17.14 35.69,18.1 36.77,19.18 46.99,19.18 49.02,21.21 v50.55,21.21
PB4/D10  (via drill 0.3)
  Top 0.203: U1.23 40.81,21.51 41.4,22.1 41.4,22.99 39.24,25.15 39.24,33.02 40.77,34.54 v40.77,36.58
  Bottom 0.203: 8~1.3 24.64,45.21 39.12,45.21 40.77,43.56 v40.77,36.58
  Bottom 0.406: 8~13.3 22.61,49.28 8~1.3
PB5/D11  (via drill 0.3)
  Top 0.203: U1.24 40.81,22.01 41.02,22.23 41.02,22.73 38.86,24.89 38.86,33.27 40.13,34.54 v40.13,35.94
  Bottom 0.203: 8~1.4 22.48,44.83 38.48,44.83 40.13,43.18 v40.13,35.94
  Bottom 0.406: 8~13.4 20.07,49.28 8~1.4
PB6/D12  (via drill 0.3)
  Top 0.203: U1.25 38.83,22.51 38.48,22.86 38.48,33.53 39.5,34.54 v39.5,36.58
  Bottom 0.203: 8~1.5 20.32,44.45 37.85,44.45 39.5,42.8 v39.5,36.58
  Bottom 0.406: 8~13.5 17.53,49.28 8~1.5
PB7/D13  (via drill 0.3)
  Top 0.203: v28.83,43.81 R9.1 | U1.26 37.75,27.97 38.1,28.32 38.1,33.78 38.86,34.54 v38.86,35.94
  Bottom 0.203: 8~1.6 18.16,44.07 28.83,44.07 | 28.83,44.07 28.19,44.07 | 28.83,44.07 28.32,44.07 | 28.83,44.07 v28.83,43.81 28.83,43.69 | 28.83,44.07 29.46,44.07 | v38.86,35.94 38.86,42.42 37.21,44.07 28.83,44.07
  Bottom 0.406: 8~13.6 14.99,49.28 8~1.6
PC0/D37  (via drill 0.3)
  Top 0.203: D30~.8 56.13,8.64 56.13,10.41 55.24,11.3 48.26,11.3 46.86,9.91 v45.85,9.91 | U1.53 25.57,21.51 25.65,21.59 v28.45,21.59
  Bottom 0.203: v28.45,21.59 27.51,21.59 23.5,17.57 23.5,13.72 26.16,11.05 32.13,11.05 32.51,10.67 42.8,10.67 43.56,9.91 v45.85,9.91
PC1/D36  (via drill 0.3)
  Top 0.203: D30~.7 55.63,11.68 47.62,11.68 v46.48,10.54 | U1.54 25.6,21.01 25.65,20.95 v27.81,20.95
  Bottom 0.203: v27.81,20.95 27.56,20.95 23.88,17.27 23.88,13.84 26.29,11.43 32.26,11.43 32.64,11.05 43.05,11.05 43.56,10.54 v46.48,10.54
PC2/D35  (via drill 0.3)
  Top 0.203: D30~.6 56.52,12.06 46.74,12.06 v45.85,11.18 | U1.55 25.46,20.51 25.65,20.32 v28.45,20.32
  Bottom 0.203: v28.45,20.32 27.56,20.32 24.26,17.02 24.26,13.97 26.42,11.81 32.38,11.81 32.77,11.43 45.59,11.43 v45.85,11.18
PC3/D34  (via drill 0.3)
  Top 0.203: U1.56 25.33,20.01 25.65,19.68 v27.81,19.68
  Bottom 0.203: D30~.5 53.72,11.81 32.89,11.81 32.51,12.19 26.54,12.19 24.64,14.1 24.64,16.76 27.56,19.68 v27.81,19.68
PC4/D33  (via drill 0.3)
  Top 0.203: U1.57 25.19,19.51 25.65,19.05 v28.45,19.05
  Bottom 0.203: D30~.4 56.13,16.76 56.13,15.03 53.29,12.19 33.02,12.19 32.64,12.57 26.67,12.57 25.02,14.22 25.02,16.51 27.56,19.05 v28.45,19.05
PC5/D32  (via drill 0.3)
  Top 0.203: U1.58 25.06,19.01 25.65,18.41 v27.81,18.41
  Bottom 0.203: D30~.3 55.75,18.92 55.75,15.27 53.06,12.57 33.15,12.57 32.77,12.95 26.8,12.95 25.4,14.35 25.4,16.26 27.56,18.41 v27.81,18.41
PC6/D31  (via drill 0.3)
  Top 0.203: U1.59 24.92,18.51 25.65,17.78 v28.45,17.78
  Bottom 0.203: D30~.2 56.09,22.86 54.61,21.38 54.61,16 52.32,13.72 33.53,13.72 33.15,14.1 28,14.1 26.8,15.3 26.8,17.02 27.56,17.78 v28.45,17.78
PC7/D30  (via drill 0.3)
  Top 0.203: U1.60 24.79,18.01 25.65,17.14 v27.81,17.14
  Bottom 0.203: D30~.1 57.15,24.64 54.23,21.72 54.23,16.26 52.07,14.1 33.66,14.1 33.27,14.48 28.19,14.48 27.18,15.49 27.18,16.51 v27.81,17.14
PD0/SCL  (via drill 0.3)
  Top 0.203: U1.43 29.25,25.57 33.53,29.84 33.53,38.48 35.81,40.77 38.86,40.77 40.13,42.04 50.42,42.04 51.51,40.94 52.63,40.94 53.72,42.04 v53.72,42.93 | I2C.3 69.34,7.11 69.34,27.05 v68.2,28.19
  Bottom 0.203: v68.2,28.19 66.29,30.1 66.29,46.45 65.75,46.99 55.88,46.99 53.72,44.83 v53.72,42.93
PD1/SDA  (via drill 0.3)
  Top 0.203: U1.44 28.75,25.57 33.15,29.97 33.15,38.73 35.56,41.15 38.23,41.15 39.5,42.42 50.67,42.42 51.59,41.51 52.3,41.51 v53.09,42.29 | I2C.4 67.31,4.45 69.72,6.86 69.72,27.56 v68.2,29.08
  Bottom 0.203: v68.2,29.08 66.8,30.48 66.8,46.61 66.04,47.37 55.63,47.37 53.09,44.83 v53.09,42.29
PD2/RX1  (via drill 0.3)
  Top 0.203: U1.45 28.25,25.58 32.77,30.1 32.77,38.99 35.31,41.53 37.59,41.53 38.86,42.8 51.31,42.8 v51.82,42.29
  Bottom 0.203: v51.82,42.29 51.82,43.31 52.32,43.81 52.32,51.18 53.59,52.45 65.66,52.45 SERIAL.1
PD3/TX1  (via drill 0.3)
  Top 0.203: U1.46 27.75,25.59 32.38,30.23 32.38,39.24 35.05,41.91 37.08,41.91 38.35,43.18 52.2,43.18 v52.45,42.93
  Bottom 0.203: v52.45,42.93 52.7,43.18 52.7,50.93 53.85,52.07 63.5,52.07 SERIAL.2
PD4
  Top 0.203: U1.47 27.25,25.6 32,30.35 32,41.21 35.88,45.09 55.88,45.09 56.26,44.7 57.66,44.7 58.67,43.69 58.67,42.67 59.18,42.16 65.66,42.16 66.8,41.02 66.8,26.92 66.04,26.16 66.04,25.78 65.66,25.4 J8.1
PD5
  Top 0.203: U1.48 26.75,25.61 31.62,30.48 31.62,41.4 35.69,45.47 54.36,45.47 55.88,46.99 57.91,46.99 58.29,46.61 58.29,44.65 58.75,44.2 65.53,44.2 67.18,42.55 67.18,27.69 68.58,26.29 68.58,24.64 68.07,24.13 66.04,24.13 J8.2
PD6
  Top 0.203: U1.49 26.25,25.61 31.24,30.61 31.24,41.6 35.49,45.85 54.1,45.85 55.63,47.37 58.17,47.37 58.67,46.86 58.67,44.83 58.93,44.58 65.79,44.58 67.56,42.8 67.56,27.94 68.96,26.54 68.96,22.35 68.2,21.59 66.04,21.59 J8.3
PD7/D38
  Top 0.203: U1.50 25.75,25.62 30.86,30.73 30.86,41.83 35.26,46.23 53.85,46.23 55.37,47.75 58.42,47.75 59.69,46.48 D38~.1
PE0/RX0/D0  (via drill 0.3)
  Top 0.203: 0~1.1 47.88,46.61 29.34,46.61 28.19,45.47 26.16,45.47 24.26,43.56 R1.2 | U1.2 42.08,11.01 48.13,17.06 48.13,35.81 v46.74,37.21
  Bottom 0.203: 0~1.1 46.48,45.21 46.48,37.47 v46.74,37.21
  Bottom 0.406: 0~1.1 0~7.1
PE1/TX0/D1  (via drill 0.3)
  Top 0.203: 0~1.2 45.72,46.99 29.08,46.99 27.94,45.85 23.75,45.85 21.46,43.56 R2.2 | U1.3 41.98,11.51 47.75,17.28 47.75,34.92 v46.1,36.58
  Bottom 0.203: 0~1.2 46.86,48.26 46.86,48.13 45.85,47.12 45.85,36.83 v46.1,36.58
  Bottom 0.406: 0~1.2 0~7.2
PE2
  Top 0.203: U1.4 38.68,12.01 38.35,11.68 38.35,10.41 38.86,9.91 41.02,9.91 45.59,5.33 62.48,5.33 J8.8
PE3/D5  (via drill 0.3)
  Top 0.203: U1.5 42.4,12.51 47.37,17.48 47.37,34.16 v45.21,36.32
  Top 0.406: 0~1.6 0~7.6
  Bottom 0.203: 0~1.6 38.1,49.53 45.21,49.53 45.72,49.02 45.72,47.75 45.21,47.24 v45.21,36.32
PE4/D2  (via drill 0.3)
  Top 0.203: U1.6 42.35,13.01 46.99,17.65 46.99,33.4 v44.96,35.43
  Top 0.406: 0~1.3 0~7.3
  Bottom 0.203: v44.96,35.43 44.58,35.81 44.58,48.13 0~1.3
PE5/D3  (via drill 0.3)
  Top 0.203: U1.7 42.27,13.51 46.61,17.85 46.61,32.51 v44.45,34.67
  Top 0.406: 0~1.4 0~7.4
  Bottom 0.203: v44.45,34.67 43.94,35.18 43.94,45.47 41.91,47.5 0~1.4
PE6
  Top 0.203: U1.8 38.52,14.01 37.97,13.46 37.97,10.29 38.73,9.53 40.89,9.53 45.47,4.95 63.63,4.95 65.79,7.11 65.79,9.14 J8.7
PE7
  Top 0.203: U1.9 38.39,14.51 37.59,13.72 37.59,10.16 38.61,9.14 40.77,9.14 45.34,4.57 63.88,4.57 66.17,6.86 66.17,11.3 J8.6
PF0/D54
  Top 0.203: U1.97 36.25,3.12 0~2.1
PF1/D55
  Top 0.203: U1.96 35.75,1.46 35.94,1.27 38.1,1.27 0~2.2
PF2/D56
  Top 0.203: 0~2.3 40.26,0.89 35.69,0.89 35.31,1.27 35.31,4.06 35.25,4.12 U1.95
PF3/D57
  Top 0.203: 0~2.4 42.42,0.51 35.43,0.51 34.92,1.02 34.92,3.81 34.75,3.98 U1.94
PF4/D58  (via drill 0.3)
  Top 0.203: U1.93 34.25,3.47 v34.29,3.43
  Bottom 0.203: 0~2.5 45.85,3.68 34.54,3.68 v34.29,3.43
PF5/D59  (via drill 0.3)
  Top 0.203: U1.92 33.75,3.9 33.66,3.81 33.66,3.17 v34.29,2.54
  Bottom 0.203: 0~2.6 48.26,1.27 35.56,1.27 v34.29,2.54
PF6/D60  (via drill 0.3)
  Top 0.203: U1.91 33.25,2.69 v34.29,1.65
  Bottom 0.203: 0~2.7 50.42,0.89 35.05,0.89 v34.29,1.65
PF7/D61  (via drill 0.3)
  Top 0.203: U1.90 32.75,4.05 v32.64,3.94
  Bottom 0.203: 0~2.8 52.58,0.51 34.29,0.51 33.02,1.78 33.02,3.56 v32.64,3.94
PG0/D41  (via drill 0.3)
  Top 0.203: U1.51 21.62,22.51 v21.59,22.48 | v36.07,42.55 36.96,42.55 37.97,43.56 53.98,43.56 54.61,42.93 54.61,40.99 55.98,39.62 58.17,39.62 D38~.4
  Bottom 0.203: v36.07,42.55 35.31,43.31 29.97,43.31 29.46,42.8 28.19,42.8 27.69,43.31 15.11,43.31 14.61,42.8 14.61,24 16.13,22.48 v21.59,22.48
PG1/D40  (via drill 0.3)
  Top 0.203: U1.52 22.39,22.01 v22.23,21.84 | v36.07,43.43 36.96,44.32 54.48,44.32 56.64,42.16 58.04,42.16 59.56,40.64 D38~.3
  Bottom 0.203: v36.07,43.43 35.81,43.69 29.72,43.69 29.21,43.18 28.45,43.18 27.94,43.69 14.99,43.69 14.22,42.93 14.22,23.75 16.13,21.84 v22.23,21.84
PG2/D39  (via drill 0.3)
  Top 0.203: U1.70 26.22,13.01 27.69,14.48 28.7,14.48 30.23,16 30.23,18.03 v30.86,18.67
  Bottom 0.203: D38~.2 58.42,44.45 56.64,44.45 55.63,43.43 55.63,42.42 54.23,41.02 52.15,41.02 45.85,34.72 45.85,23.11 44.96,22.23 34.42,22.23 v30.86,18.67
PG3  (via drill 0.3)
  Top 0.203: J8.5 62.99,17.02 62.99,26.29 63.63,26.92 65.41,26.92 66.04,27.56 66.04,38.48 65.15,39.37 59.31,39.37 58.42,40.26 58.42,41.15 57.91,41.66 56.52,41.66 54.23,43.94 37.47,43.94 v36.96,43.43 | U1.28 36.75,27.48 37.72,28.45 37.72,34.04 38.23,34.54 v38.23,36.58
  Bottom 0.203: v38.23,36.58 38.23,42.16 v36.96,43.43
PG4  (via drill 0.3)
  Top 0.203: J8.4 63.37,19.18 63.37,26.04 63.75,26.42 65.53,26.42 66.42,27.3 66.42,40.77 65.53,41.66 59.11,41.66 58.29,42.47 58.29,43.46 57.55,44.2 56.13,44.2 55.63,44.7 36.07,44.7 35.18,43.81 v35.18,42.55 | U1.29 36.25,27.49 37.34,28.57 37.34,34.29 37.59,34.54 v37.59,35.94
  Bottom 0.203: v35.18,42.55 35.81,41.91 37.08,41.91 37.59,41.4 v37.59,35.94
PG5/D4  (via drill 0.3)
  Top 0.203: U1.1 42.17,10.51 48.51,16.86 48.51,36.7 v47.37,37.85
  Top 0.406: 0~7.5 0~1.5
  Bottom 0.203: 0~7.5 40.64,52.07 50.55,52.07 51.05,51.56 51.05,47.24 47.12,43.31 47.12,38.1 v47.37,37.85
PH0/RXD2  (via drill 0.3)
  Top 0.203: U1.12 41.28,16.01 v41.91,16.64 | v62.23,45.72 SERIAL.3
  Bottom 0.203: v41.91,16.64 50.8,16.64 51.94,17.78 51.94,22.48 53.98,24.51 53.98,29.72 56.26,32 60.71,32 61.47,32.77 61.47,44.96 v62.23,45.72
PH1/TXD2  (via drill 0.3)
  Top 0.203: U1.13 40.89,16.51 v41.02,16.64 | v61.34,45.72 61.34,49.15 SERIAL.4
  Bottom 0.203: v41.02,16.64 41.66,17.27 50.8,17.27 51.56,18.03 51.56,22.61 53.59,24.64 53.59,29.97 56.13,32.51 56.13,33.66 56.77,34.29 60.33,34.29 61.09,35.05 61.09,45.47 v61.34,45.72
PH2  (via drill 0.3)
  Top 0.203: U1.14 38.73,17.01 38.35,16.64 v38.35,16.26
  Bottom 0.203: J10.1 61.85,42.8 61.85,32.56 60.78,31.5 56.39,31.5 54.36,29.46 54.36,24.38 52.32,22.35 52.32,17.53 50.8,16 38.61,16 v38.35,16.26
PH3/D6  (via drill 0.3)
  Top 0.203: U1.15 41.13,17.51 42.16,18.54 42.16,20.45 42.93,21.21 42.93,23.62 43.18,23.88 45.34,23.88 45.85,24.38 45.85,31.75 43.31,34.29 v43.31,36.58
  Bottom 0.203: 0~1.7 35.81,46.74 41.66,46.74 43.31,45.09 v43.31,36.58
  Bottom 0.406: 0~1.7 0~7.7
PH4/D7  (via drill 0.3)
  Top 0.203: U1.16 41,18.01 41.78,18.8 41.78,20.7 42.55,21.46 42.55,23.88 42.93,24.26 45.09,24.26 45.47,24.64 45.47,31.5 42.67,34.29 v42.67,35.94
  Bottom 0.203: 0~1.8 33.66,46.35 41.02,46.35 42.67,44.7 v42.67,35.94
  Bottom 0.406: 0~1.8 0~7.8
PH5/D8  (via drill 0.3)
  Top 0.203: U1.17 40.86,18.51 41.4,19.05 41.4,20.95 42.16,21.72 42.16,23.5 40.01,25.65 40.01,32.51 42.04,34.54 v42.04,36.58
  Bottom 0.203: 8~1.1 28.96,45.97 40.39,45.97 42.04,44.32 v42.04,36.58
  Bottom 0.406: 8~13.1 27.69,49.28 8~1.1
PH6/D9  (via drill 0.3)
  Top 0.203: U1.18 40.73,19.01 41.02,19.3 41.02,21.21 41.78,21.97 41.78,23.24 39.62,25.4 39.62,32.77 41.4,34.54 v41.4,35.94
  Bottom 0.203: 8~1.2 26.8,45.59 39.75,45.59 41.4,43.94 v41.4,35.94
  Bottom 0.406: 8~13.2 25.15,49.28 8~1.2
PH7  (via drill 0.3)
  Top 0.203: U1.27 37.25,20.23 34.92,17.91 34.92,16.89 35.94,15.88 v37.47,15.88
  Bottom 0.203: J10.2 62.23,40.64 62.23,30.99 60.71,29.46 55.88,29.46 54.74,28.32 54.74,24.26 52.7,22.23 52.7,17.27 51.05,15.62 37.72,15.62 v37.47,15.88
PJ0/RXD3  (via drill 0.3)
  Top 0.203: U1.63 22.73,16.51 22.35,16.13 v21.46,16.13 | v14.22,44.96 14.22,46.23 14.61,46.61 27.43,46.61 29.72,48.9 29.72,51.44 30.73,52.45 55.5,52.45 SERIAL.5
  Bottom 0.203: v21.46,16.13 21.21,16.13 13.84,23.5 13.84,44.58 v14.22,44.96
PJ1/TXD3  (via drill 0.3)
  Top 0.203: U1.64 22.87,16.01 22.1,15.24 v21.46,15.24 | v14.86,45.72 15.37,46.23 27.69,46.23 30.1,48.64 30.1,51.18 30.99,52.07 53.34,52.07 SERIAL.6
  Bottom 0.203: v21.46,15.24 13.46,23.24 13.46,45.21 13.97,45.72 v14.86,45.72
PJ2  (via drill 0.3)
  Top 0.203: U1.65 24.65,15.51 25.65,16.51 v28.45,16.51
  Bottom 0.203: J10.3 62.61,38.48 62.61,30.74 60.83,28.96 56.01,28.96 55.12,28.07 55.12,24.13 53.09,22.1 53.09,17.02 51.31,15.24 34.04,15.24 33.66,15.62 29.59,15.62 28.7,16.51 v28.45,16.51
PJ3  (via drill 0.3)
  Top 0.203: U1.66 24.66,15.01 25.65,16 27.69,16 v27.81,15.88
  Bottom 0.203: J10.4 62.99,36.32 62.99,29.72 60.2,26.92 56.01,26.92 55.5,26.42 55.5,24 53.47,21.97 53.47,16.76 51.56,14.86 33.91,14.86 33.53,15.24 29.34,15.24 28.7,15.88 v27.81,15.88
PJ4  (via drill 0.3)
  Top 0.203: U1.67 24.67,14.51 25.78,15.62 27.18,15.62 27.56,15.24 v28.45,15.24
  Bottom 0.203: J10.5 63.37,34.16 63.37,29.46 60.33,26.42 56.13,26.42 55.88,26.16 55.88,23.88 53.85,21.84 53.85,16.51 51.82,14.48 33.78,14.48 33.4,14.86 28.83,14.86 v28.45,15.24
PJ5  (via drill 0.3)
  Top 0.203: U1.68 25.06,14.01 v26.04,14.99
  Bottom 0.203: J10.6 63.75,32 63.75,29.21 60.96,26.42 60.96,22.48 60.33,21.84 55.88,21.84 54.99,20.95 54.99,15.75 52.58,13.34 33.4,13.34 33.02,13.72 27.81,13.72 26.54,14.99 v26.04,14.99
PJ6  (via drill 0.3)
  Top 0.203: U1.69 25.7,13.51 v26.42,14.22
  Bottom 0.203: J10.7 64.77,29.59 61.47,26.29 61.47,22.35 60.45,21.34 56.01,21.34 55.37,20.7 55.37,15.49 52.83,12.95 33.27,12.95 32.89,13.34 27.3,13.34 v26.42,14.22
PJ7  (via drill 0.3)
  Top 0.203: U1.79 27.25,9.34 28.96,11.05 30.35,11.05 v30.99,10.41 | J10.8 64.01,27.94 62.61,26.54 62.61,7.75 61.21,6.35 56.64,6.35 55.75,7.24 55.75,10.03 54.86,10.92 48.77,10.92 v47.12,9.27
  Bottom 0.203: v30.99,10.41 31.62,9.78 32.13,9.78 32.26,9.91 42.29,9.91 43.31,8.89 46.74,8.89 v47.12,9.27
PL0/D49
  Top 0.203: U1.35 33.25,25.5 36.58,28.83 36.58,36.45 37.85,37.72 43.94,37.72 45.21,38.99 48.39,38.99 49.53,37.85 49.53,33.4 51.31,31.62 52.68,31.62 53.72,30.58 53.72,21.21 55.88,19.05 58.42,19.05 D46~.4
PL1/D48
  Top 0.203: U1.36 32.75,25.51 36.2,28.96 36.2,36.7 37.59,38.1 43.31,38.1 44.58,39.37 48.64,39.37 49.91,38.1 49.91,33.53 51.44,32 52.88,32 54.1,30.78 54.1,23.37 55.88,21.59 58.42,21.59 D46~.3
PL2/D47
  Top 0.203: U1.37 32.25,25.52 35.81,29.08 35.81,36.96 37.34,38.48 42.67,38.48 43.94,39.75 48.9,39.75 50.29,38.35 50.29,33.66 51.56,32.38 53.08,32.38 54.48,30.98 54.48,25.53 55.88,24.13 58.42,24.13 D46~.2
PL3/D46
  Top 0.203: U1.38 31.75,25.53 35.43,29.21 35.43,37.21 37.08,38.86 42.04,38.86 43.31,40.13 49.15,40.13 50.67,38.61 50.67,33.78 51.69,32.77 53.28,32.77 54.86,31.18 54.86,27.69 55.88,26.67 58.42,26.67 D46~.1
PL4/D45
  Top 0.203: U1.39 31.25,25.54 35.05,29.34 35.05,37.47 36.83,39.24 41.4,39.24 42.67,40.51 49.4,40.51 50.67,39.24 53.47,39.24 55.88,36.83 55.88,34.92 56.52,34.29 57.63,34.29 58.17,33.75 58.17,29.46 D38~.8
PL5/D44
  Top 0.203: U1.40 30.75,25.54 34.67,29.46 34.67,37.72 36.58,39.62 40.77,39.62 42.04,40.89 49.66,40.89 50.93,39.62 53.65,39.62 56.57,36.7 57.53,36.7 58.17,36.07 58.17,34.54 58.67,34.04 58.67,31.5 D38~.7
PL6/D43
  Top 0.203: U1.41 30.25,25.55 34.29,29.59 34.29,37.97 36.32,40.01 40.13,40.01 41.4,41.27 49.91,41.27 51.18,40.01 53.82,40.01 56.74,37.08 57.76,37.08 58.67,36.17 58.67,34.8 59.69,33.78 D38~.6
PL7/D42
  Top 0.203: U1.42 29.75,25.56 33.91,29.72 33.91,38.23 36.07,40.39 39.5,40.39 40.77,41.66 50.16,41.66 51.44,40.39 53.98,40.39 55.24,39.12 57.91,39.12 58.42,38.61 58.42,37.08 59.69,35.81 D38~.5
RESET_1280  (via drill 0.3)
  Top 0.203: R6.1 v20.32,7.87 | U1.30 35.75,23.3 32.13,19.68 v29.21,19.68
  Top 0.305: J11.6 18.29,1.78 12.45,1.78 RESET.P$2
  Top 0.406: C1.1 14.61,8.76 15.37,9.53 17.65,9.53 18.41,8.76 RST.2 | RST.2 R6.1 | RST.2 18.41,3.17 J11.6
  Bottom 0.203: ISP.3 50.8,26.67 52.58,26.67 53.21,26.04 53.21,24.77 51.18,22.73 51.18,18.29 50.55,17.65 38.35,17.65 36.32,15.62 34.29,15.62 33.91,16 30.35,16 29.21,17.14 v29.21,19.68 29.21,21.84 28.83,22.23 27.56,22.23 23.11,17.78 23.11,10.67 v20.32,7.87
RI  (via drill 0.3)
  Top 0.305: U2.6 21.3,36.11 v21.46,35.94
  Bottom 0.203: v21.46,35.94 26.54,30.86 39.62,30.86 41.27,29.21 43.18,29.21 UART.5
RTS  (via drill 0.3)
  Top 0.305: U2.3 23.25,36.58 v22.61,35.94
  Bottom 0.203: v22.61,35.94 27.3,31.24 41.15,31.24 UART.1
V_IN
  Top 0.813: J11.1 29.97,0.76 10.03,0.76 D1.+ | D1.+ 6.99,2.29 JST.+ | D1.+ 8.51,3.81 10.79,6.1 C11.+
V_JST
  Top 0.813: EXT_PWR_USB.COM1 7.11,16.13 11.3,16.13 U6.2
VCC_LOG  (via drill 0.3)
  Top 0.203: 43.69,37.34 38.1,37.34 36.96,36.2 36.96,28.7 35.25,27 U1.31 | 43.81,37.34 43.69,37.34 | 43.43,37.34 43.18,37.34 | 43.69,37.34 43.43,37.34 | 43.81,37.34 44.2,37.34 | 43.43,37.34 43.56,37.34 | 43.81,37.34 43.43,37.34 | 44.32,37.08 44.32,36.07 43.81,35.56 43.81,34.42 46.23,32 46.23,18.16 44.58,16.51 C5.2 | 44.32,37.08 44.07,37.34 43.81,37.34 | 43.81,37.34 44.32,37.34 44.32,37.08 | 44.32,37.08 44.58,37.34 43.81,37.34 | 35.25,24.19 35.31,24.13
  Top 0.305: 21.21,17.53 20.32,18.41 | 21.23,17.51 20.34,17.51 20.32,17.53 | 20.32,16.76 20.45,16.76 21.21,17.53 | 21.21,17.53 20.95,17.53 | 20.95,17.53 20.83,17.53 20.32,17.02 20.32,18.03 20.45,18.03 20.95,17.53 | 21.23,17.51 U1.61 | 21.21,17.53 21.23,17.51 | 20.32,13.84 20.32,14.61 19.56,13.84 | 20.32,13.84 19.56,13.84 | 20.32,13.84 20.32,13.08 | 20.32,13.08 20.32,12.83 | 19.56,13.84 20.32,13.08 | 19.56,13.84 R7.1 | U1.80 27.75,7.43 26.16,5.84 24.89,5.84 | 24.13,5.84 24.13,6.6 | 24.13,6.6 24.13,6.73 | 24.13,6.6 24.89,5.84 | 24.13,5.84 24.89,5.84 | 24.13,5.84 24.13,5.08 | 24.13,5.08 24.13,4.83 | 24.89,5.84 24.13,5.08 | C3.2 18.41,23.88 18.8,23.5 24.26,23.5 25.27,22.48 30.1,22.48 | 30.1,22.48 34.16,22.48 35.25,23.57 35.25,24.19 | v34.67,16.26 35.92,15.01 U1.10 42.7,15.01 43.56,15.88 C5.2 | 30.1,22.48 29.59,22.48 | 29.59,22.48 29.34,22.48 | 29.59,22.48 30.1,21.97 | 30.1,22.48 30.1,21.97 | 30.1,22.48 30.61,22.48 | 30.61,22.48 30.73,22.48 | 30.1,21.97 30.61,22.48 | 30.1,21.97 v30.1,21.34 | ISP.6 51.82,30.48 49.02,33.27 49.02,37.59 48.06,38.56 45.8,38.56 44.58,37.34
  Top 0.762: U3.3 14.22,25.4 15.24,24.38 C4.1 17.53,24.38 17.65,24.51 C3.2
  Top 0.813: C12.+ C4.1 | C12.+ 14.99,22.73 14.86,22.86 F1.2 11.94,22.86 11.3,23.5 3V3_VCC_5V.B | J11.4 24.13,5.84 24.13,6.86 20.57,10.41 R6.2 20.32,13.84 20.32,16.76 20.32,17.02 20.32,17.53 20.32,18.03 20.32,18.41 20.32,20.57 18.16,22.73 C12.+
  Bottom 0.305: v34.67,16.26 34.29,16.64 30.61,16.64 30.1,17.14 v30.1,21.34
  pour Top: -7.62,50.16 -5.08,50.16 -5.08,48.26 -7.62,48.26
VCC_SW  (via drill 0.3)
  Top 0.203: U1.100 37.75,8.1 37.85,8
  Top 0.305: I2C.1 58.17,4.06 45.21,4.06 40.77,8.51 U1.100 | v38.23,6.6 38.23,7.62 37.85,8
  Top 0.406: 3V3_VCC_5V.COM 4.19,26.54 2.01,24.37 2.01,19.96 2.54,19.43 9.4,19.43 11.05,17.78 13.97,17.78 16.26,15.49 C13.1 R8.1 v15.62,13.84
  Top 0.813: C2.2 17.65,15.62 17.53,15.49 C13.1
  Bottom 0.406: v38.23,6.6 38.1,6.48 35.18,6.48 34.67,6.99 16.89,6.99 15.62,8.26 v15.62,13.84
VDD5_USB  (via drill 0.51 pad 1.02)
  Top 0.203: 25.4,32.38 29.54,32.38 29.72,32.56 29.72,34.8 29.46,35.05 R5.1
  Top 0.305: 25.4,32.38 24.26,33.53 19.68,33.53 19.34,33.19 U2.20 | R5.1 28.7,35.05 R3.2 R4.2 26.04,38.48 25.53,38.99 25.53,41.53 25.02,42.04 22.86,42.04 | C8.+ 17.4,43.43 19.05,43.43 20.45,42.04 22.86,42.04 | 7.37,42.67 J1.VDD | U2.4 22.59,40.25 22.86,40.51 22.86,41.53 | 23.37,42.04 22.86,41.53 | 23.37,42.04 23.62,42.04 | 22.86,42.04 23.37,42.04 | 22.86,42.04 22.86,41.53 | 22.86,41.53 22.35,42.04 | 22.35,42.04 22.23,42.04 | 22.86,42.04 22.35,42.04
  Top 0.813: 6.35,42.67 7.37,42.67 v8.89,42.67 C10.2 C7.1 15.37,42.67 C8.+
  Bottom 0.813: EXT_PWR_USB.CH2B 0.76,28.07 0.76,37.08 6.35,42.67 v8.89,42.67

### Text on the board
Top: top layer
Bottom: bottom layer
Dimension: boardoutline
tPlace: 14 | 15 | 16 | 17 | 18 | 19 | TX3 | RX3 | TX2 | RX2 | TX1 | RX1 | silktop | AREF | GND | 1 | 1 | 1 | 1 | 9 | 8 | 7 | 6 | 5 | 4 | 3 | 2 | 1 | 0 | 3 | 2 | 1 | 0 | 22 | 38 | PH2 | PWM | TX0 | RX0 | 23 | 39 | PH7 | Seeeduino Mega | 24 | 40 | PJ2 | v1.1 06/24/2009 | 25 | 41 | PJ3 | ANALOG IN | 26 | 42 | PJ4 | by Seeed Studio | Partner w/ NKC electronics | 27 | 43 | PJ5 | RTS | DTR | 28 | 44 | PJ6 | DSR | RI | 29 | 45 | PJ7 | CTS | DCD | 30 | 46 | PD4 | 8 | 31 | 47 | PD5 | 9 | 32 | 48 | PD6 | 10 | 33 | 49 | PG4 | 11 | 34 | 50 | 12 | PG3 | 35 | 51 | PE7 | 13 | 36 | 52 | 14 | PE6 | AREF | 37 | 53 | PE2 | 15 | POWER | ANALOG IN | RST | 3V3 | 5V | GND | Vin | 0 | 1 | 2 | 3 | 4 | 5 | 6 | 7 | VCC | GND | SCL | SDA | 21 | 20
bPlace: 14 | 15 | 16 | 17 | 18 | 19 | silkbottom | TX3 | RX3 | TX2 | RX2 | TX1 | RX1 | SERIAL | AREF | GND | 22 | PH2 | 1 | 1 | 1 | 1 | 9 | 8 | 7 | 6 | 5 | 4 | 3 | 2 | 1 | TX0 | 0 | RX0 | 38 | 3 | 2 | 1 | 0 | 23 | PH7 | PWM | 24 | 39 | PJ2 | 40 | Electronics can be art | 25 | PJ3 | ANALOG IN | 26 | 41 | PJ4 | 42 | 27 | PJ5 | seeedstudio.com | 1 | 43 | PJ6 | CC | DTR | 28 | A_RST_M | RTS | 44 | 29 | PJ7 | RI | DSR | 45 | PD4 | DCD | 30 | 8 | 5V_VCC_3V3 | CTS | 46 | 31 | PD5 | 9 | 47 | PD6 | 32 | 10 | USB_PWR_EXT | 33 | 48 | PG4 | 11 | 49 | PG3 | 34 | 12 | 35 | 50 | PE7 | 13 | 51 | 36 | PE6 | 14 | 37 | 52 | PE2 | 15 | 53 | - | RST | 3V3 | 5V | GND | Vin | 0 | 1 | 2 | 3 | 4 | 5 | 6 | 7 | VCC | GND | SCL | SDA | + | 21 | 20
tStop: ~soldermask top
bStop: ~soldermask bottom
tCream: ~padmask top
bCream: ~padmask bottom
Drills: drill
Reference: SUPER